# EAGLE design 180V_power (EAGLE 6.4)
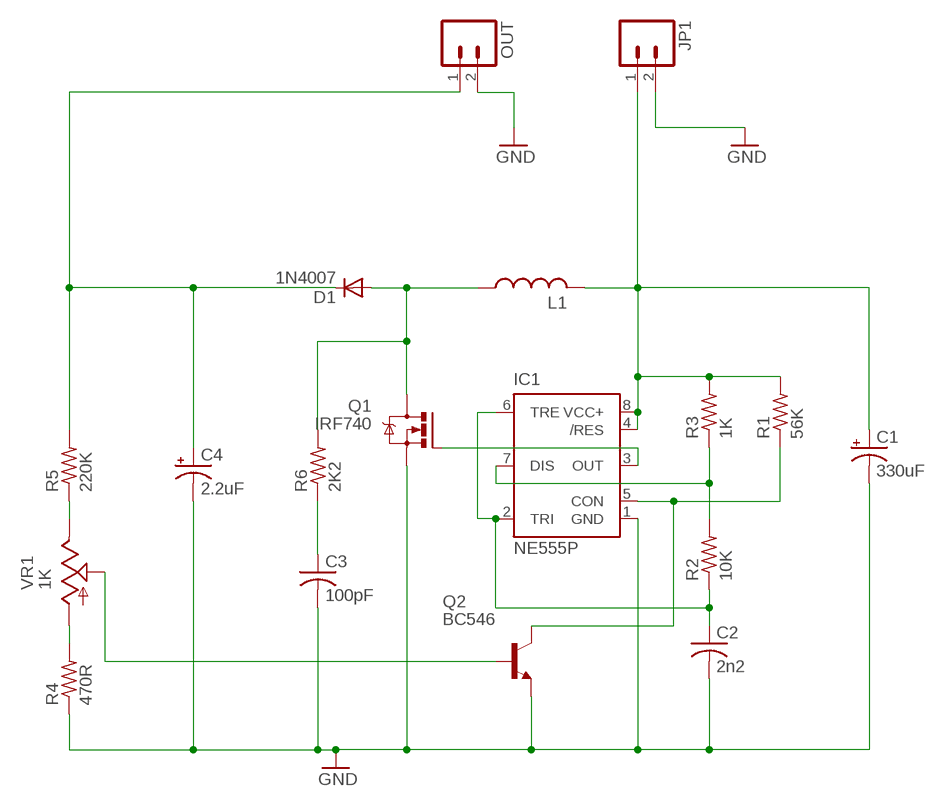
[diagram p0: schematic, sheet 1]

## Parts
C1  330uF  CAPACITOR_POLE5-10.5  [E5-10,5]
C2  2n2  CAPACITOR050-025X075  [C050-025X075]
C3  100pF  CAPACITOR050-025X075  [C050-025X075]
C4  2.2uF  CAPACITOR_POLE3.5-8  [E3,5-8]
D1  1N4007  DIODEPTH  [DIODE-1N4001]
IC1  NE555P  [DIL08]
JP1  M023.5MM  [SCREWTERMINAL-3.5MM-2]
L1  INDUCTOR  [RBL0712]
OUT  M023.5MM  [SCREWTERMINAL-3.5MM-2]
Q1  IRF740  [TO220BV]
Q2  BC546  BC546A  [TO92-EBC]
R1  56K  RESISTOR0207/10  [0207/10]
R2  10K  RESISTOR0207/10  [0207/10]
R3  1K  RESISTOR0207/10  [0207/10]
R4  470R  RESISTOR0207/10  [0207/10]
R5  220K  RESISTOR0207/10  [0207/10]
R6  2K2  RESISTOR0207/10  [0207/10]
VR1  1K  TRIM_POTCA6V  [CA6V]

## Nets
GND: C1.- C2.2 C3.2 C4.- IC1.1(GND) JP1.2 OUT.2 Q1.S Q2.E R4.1
N$1: IC1.3(OUT) Q1.G
N$2: C3.1 R6.1
N$3: IC1.5(CON) Q2.C R1.1
N$4: IC1.7(DIS) R2.2 R3.1
N$5: C2.1 IC1.2(TRI) IC1.6(TRE) R2.1
N$6: D1.A L1.P$1 Q1.D R6.2
N$7: C4.+ D1.C OUT.1 R5.2
N$8: R5.1 VR1.E
N$9: R4.2 VR1.A
N$10: Q2.B VR1.S
N$26: C1.+ IC1.4(/RES) IC1.8(VCC+) JP1.1 L1.P$2 R1.2 R3.2

## Library data of the parts
C1 C4 = iStivi - RCLD:CAPACITOR_POL: POLARIZED CAPACITOR, American symbol
C2 C3 = iStivi - RCLD:CAPACITOR: CAPACITOR, American symbol
D1 = iStivi - RCLD:DIODE: Diode These are standard reverse protection diodes and small signal diodes.
IC1 = iStivi - ICs:NE555: Timer General purpose bipolar Timer; MF: Arrow Electronics; MPN: NE555N; OC_FARNELL: 1467742; OC_NEWARK: 89K1486
JP1 OUT = iStivi - Header-Connector:M02: Header 2 Standard 2-pin 0.1" header. Use with straight break away headers (SKU : PRT-00116), right angle break away headers (PRT-00553), swiss pins (PRT-00743), machine pins (PRT-00117), and female headers (PRT-00115). Molex polarized connector foot print use with SKU : PRT-08233 with associated crimp pins and housings.
L1 = iStivi - RCLD:INDUCTOR: INDUCTOR
Q1 = iStivi - Transistor-FET:IRF740: N-CHANNEL MOS FET 400V MOSFET
Q2 = iStivi - Transistor-FET-reg:BC546*: NPN Transistor
R1-R6 = iStivi - RCLD:RESISTOR: RESISTOR
VR1 = iStivi - RCLD:TRIM_POT: POTENTIOMETER

## Board
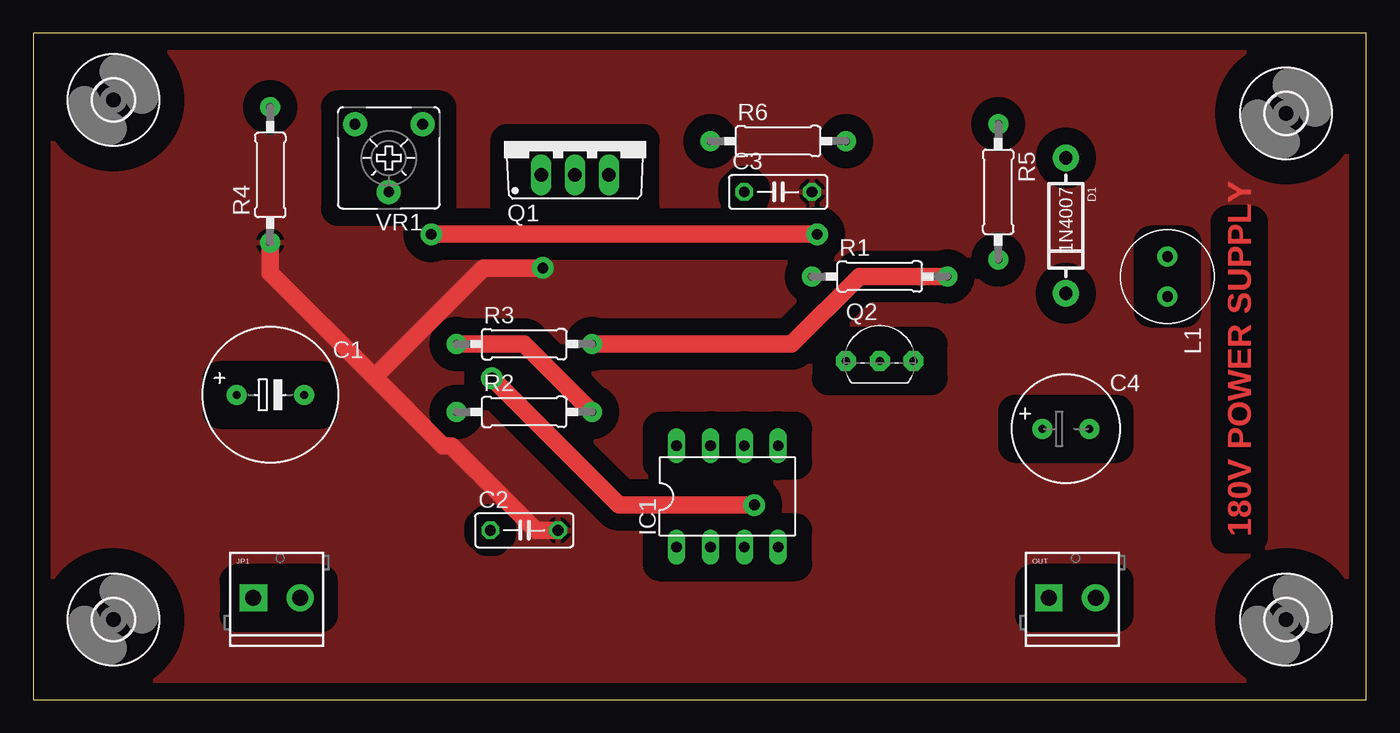
[diagram p1: board, top side]
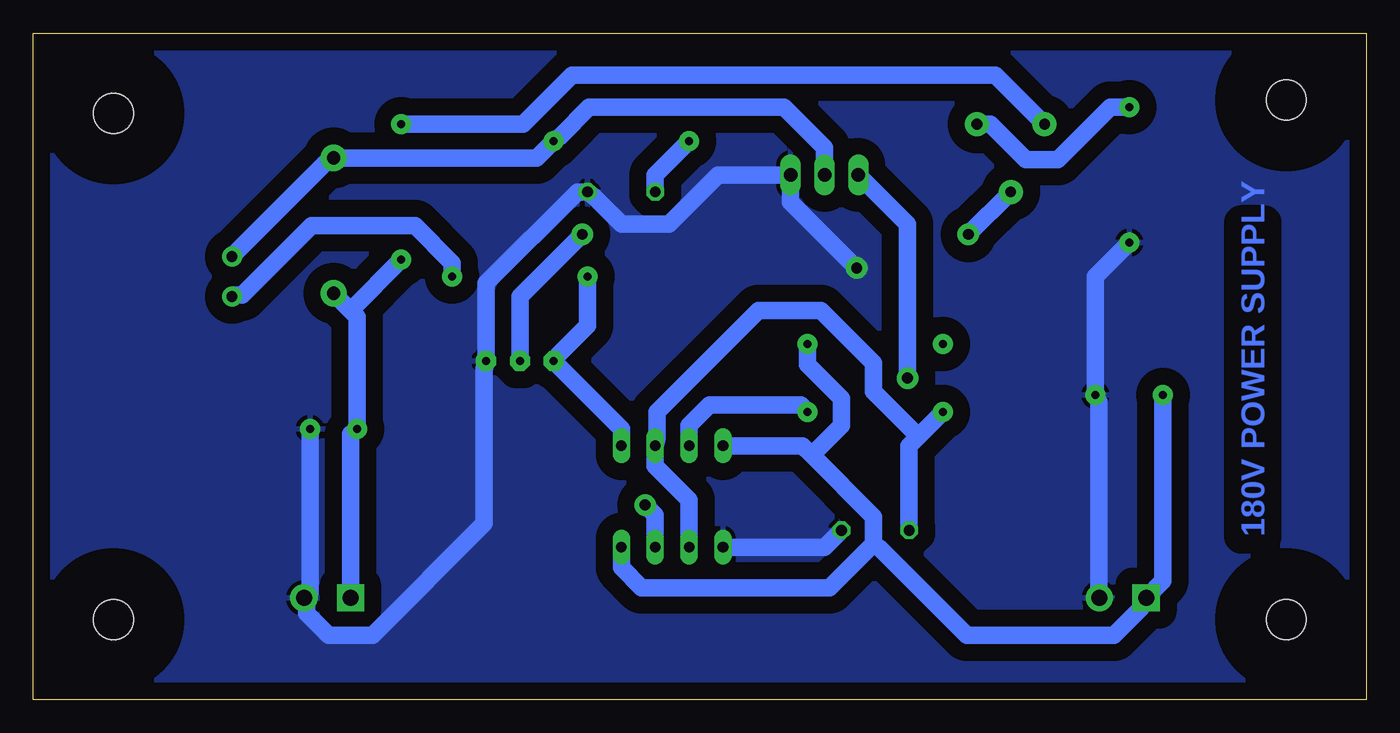
[diagram p2: board, bottom side, seen from below]

Size 100 x 50 mm. Coordinates in mm from the lower left corner, seen from the top.
Outline: 0,0 100,0 100,50 0,50 0,0
Copper layers (1*16): Top 0.035mm / dielectric 1.5mm / Bottom 0.035mm
Design rules "iStivi-0.8mm via-20mil-track *": minimum track width 52mil, minimum drill 0.8mm, track to track 40mil, track to pad 40mil, pad to pad 40mil, via to via 40mil, smd to smd 10mil, copper to edge 40mil, drill to drill 8mil, minimum pad ring 10mil, minimum via ring 16mil, stop-mask expansion 0mil, vias tented up to drill 0mil, thermal gap 12mil
tRestrict: area 26.3,68 to 28.6,70.3; area 29.9,68 to 32.2,70.3; area 40.1,57.7 to 42.2,59.4; area 40.1,54.1 to 42.2,55.9; area 35.6,36.8 to 45.7,41.9; area 22.9,36.8 to 30.5,44.5; area 14,21.6 to 21.6,24.1; area 15.2,6.3 to 21.6,8.9; area 74.9,6.3 to 81.3,8.9; area 47,17.8 to 57.1,20.3; area 47,10.2 to 57.1,12.7; area 59.7,24.1 to 67.3,26.7; 2 more areas

### Footprints (pad centres in the part's own frame; a part is rotated, then mirrored left to right if it is on the bottom)
E5-10,5 = drill 0.6 pad 1.5: + -2.54,0; - 2.54,0
C050-025X075 = drill 0.813 octagon: 1 -2.54,0; 2 2.54,0
E3,5-8 = drill 0.6 pad 1.5: + -1.778,0; - 1.778,0
DIODE-1N4001 = drill 1 pad 1.981: A -5.08,0; C 5.08,0
DIL08 = drill 0.8 long: 1 -3.81,-3.81; 2 -1.27,-3.81; 3 1.27,-3.81; 4 3.81,-3.81; 5 3.81,3.81; 6 1.27,3.81; 7 -1.27,3.81; 8 -3.81,3.81
SCREWTERMINAL-3.5MM-2 = drill 1.2 pad 2.032 square: 1 0,0 | drill 1.2 pad 2.032: 2 3.5,0
RBL0712 = drill 0.8 pad 1.5: P$1 -1.5,0; P$2 1.5,0
TO220BV = drill 1.016 long: D 0,-2.54; G -2.54,-2.54; S 2.54,-2.54
TO92-EBC = drill 0.6 pad 1.5 octagon: B 0,-1.27; C -2.54,-1.27; E 2.54,-1.27
0207/10 = drill 0.6 pad 1.5: 1 -5.08,0; 2 5.08,0
3,0 = hole 3: 0,0
CA6V = drill 0.8 pad 1.8: A -2.54,-2.54; E 2.54,-2.54; S 0,2.54

### Placement (x,y rotation side)
C1  17.78,22.86 0 top
C2  36.83,12.7 0 top
C3  55.88,38.1 0 top
C4  77.47,20.32 0 top
D1  77.47,35.56 270 top
IC1  52.07,15.24 0 top
JP1  16.51,7.62 0 top
L1  85.09,31.75 270 top
OUT  76.2,7.62 0 top
Q1  40.64,41.91 0 top
Q2  63.5,26.67 0 top
R1  63.5,31.75 0 top
R2  36.83,21.59 0 top
R3  36.83,26.67 0 top
R4  17.78,39.37 90 top
R5  72.39,38.1 270 top
R6  55.88,41.91 0 top
U$1  [3,0]  6,6 0 top
U$2  [3,0]  94,6 0 top
U$3  [3,0]  94,44 0 top
U$4  [3,0]  6,45 0 top
VR1  26.67,40.64 180 top

### Tracks (layer width: path | path; a pad name or v marks a point on that pad's centre or on a via)
GND  (via drill 0.8)
  Top 1.321: C2.2 37.72,12.7 31.37,19.05 30.73,19.05 25.59,24.19 | 25.59,24.19 17.78,32 R4.1 | 25.59,24.19 33.78,32.38 v38.23,32.38
  Bottom 1.321: IC1.1 40.64,11.43 C2.2 | R4.1 20.32,31.75 C1.- 20.07,22.35 20.07,7.62 JP1.2 | C4.- 79.25,8 79.63,7.62 OUT.2 79.5,6.99 79.5,6.48 77.85,4.83 74.55,4.83 66.17,13.21 66.17,24.77 Q2.E 66.04,31.24 59.18,38.1 C3.2 57.91,37.72 55.88,35.69 52.32,35.69 48.64,39.37 Q1.S 43.18,37.34 v38.23,32.38
  pour Bottom (isolate 1.27): 0,0 100.33,0 100.33,49.53 0,49.53
  pour Top (isolate 1.27): 0,0 100.33,0 100.33,49.53 0,49.53
N$1  (via drill 0.8)
  Top 1.321: v54.1,14.61 43.94,14.61 v34.42,24.13
  Bottom 1.321: IC1.3 53.34,13.84 v54.1,14.61 | v34.42,24.13 34.42,35.69 Q1.G
N$2
  Bottom 1.321: C3.1 53.34,39.37 R6.1
N$3
  Bottom 1.321: IC1.5 55.88,20.32 Q2.C 60.58,25.91 58.42,28.07 R1.1
N$4
  Top 1.321: R3.1 36.83,26.67 R2.2
  Bottom 1.321: IC1.7 50.8,20.57 49.28,22.1 42.42,22.1 R2.2
N$5
  Bottom 1.321: IC1.2 50.8,14.99 53.34,17.53 IC1.6 53.21,19.68 53.21,21.59 45.59,29.21 40.89,29.21 36.96,25.27 36.96,23.11 33.59,19.75 | C2.1 34.29,19.05 33.59,19.75 | R2.1 33.59,19.75
N$6
  Bottom 1.321: L1.P$1 85.09,33.27 77.98,40.39 D1.A 62.23,40.64 R6.2 60.45,42.29 58.29,44.45 43.69,44.45 40.64,41.4 Q1.D
N$7
  Bottom 1.321: D1.C 76.2,29.21 | 76.2,29.21 75.69,28.7 C4.+ 76.2,19.94 OUT.1 | 76.2,29.21 R5.2
N$8
  Bottom 1.321: R5.1 63.25,43.18 59.56,46.86 27.81,46.86 VR1.E
N$9
  Bottom 1.321: R4.2 19.18,44.45 23.11,40.51 25.53,40.51 28.19,43.18 VR1.A
N$10  (via drill 0.8)
  Top 1.321: v29.84,34.92 v58.8,34.92
  Bottom 1.321: Q2.B 63.5,30.23 v58.8,34.92 | VR1.S v29.84,34.92
N$26
  Top 1.321: R1.2 61.98,31.75 56.9,26.67 R3.2
  Bottom 1.321: R1.2 68.58,32.77 71.37,35.56 79.12,35.56 84.33,30.35 85.09,30.35 L1.P$2 | C1.+ 15.24,8.89 JP1.1 16.89,7.11 16.89,6.86 18.92,4.83 29.97,4.83 36.45,11.3 36.96,11.68 | IC1.4 55.88,9.91 54.36,8.38 40.26,8.38 36.96,11.68 | 36.96,11.68 36.96,13.72 41.59,18.35 | 41.59,18.35 42.29,19.05 IC1.8 | R3.2 41.91,25.15 39.37,22.61 39.37,20.57 41.59,18.35

### Text on the board
Top: 180V POWER SUPPLY
Bottom: 180V POWER SUPPLY